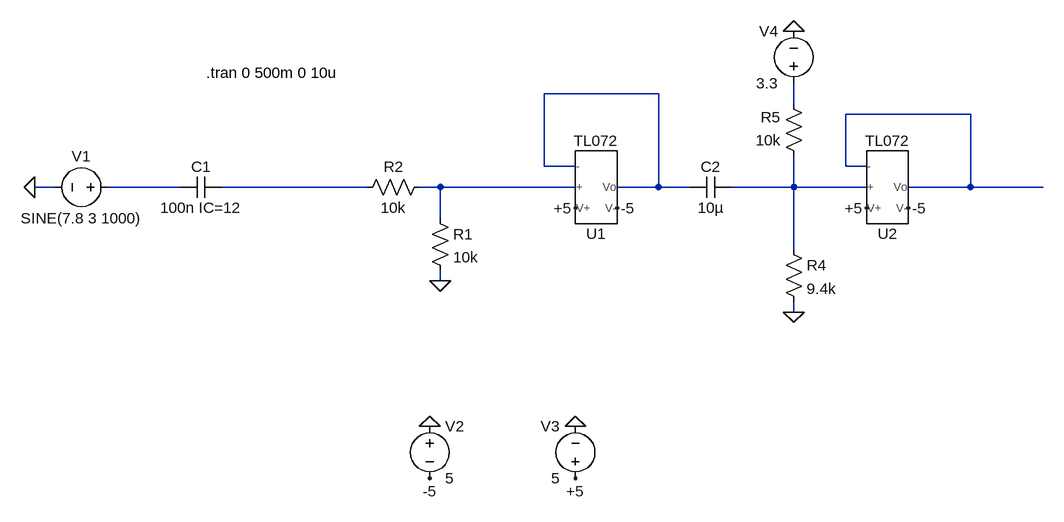
[diagram p0: schematic Draft2.asc]
Draft2.asc, the LTspice schematic file:
Version 4.1
SHEET 1 1140 680
WIRE 544 0 368 0
WIRE 752 16 752 -16
WIRE 1024 32 832 32
WIRE 368 112 368 0
WIRE 416 112 368 112
WIRE 832 112 832 32
WIRE 864 112 832 112
WIRE -384 144 -416 144
WIRE -192 144 -304 144
WIRE 96 144 -128 144
WIRE 208 144 176 144
WIRE 416 144 208 144
WIRE 544 144 544 0
WIRE 544 144 480 144
WIRE 592 144 544 144
WIRE 752 144 752 96
WIRE 752 144 656 144
WIRE 864 144 752 144
WIRE 1024 144 1024 32
WIRE 1024 144 928 144
WIRE 1136 144 1024 144
WIRE 208 192 208 144
WIRE 752 240 752 144
WIRE 208 288 208 272
WIRE 752 336 752 320
FLAG -416 144 0
FLAG 208 288 0
FLAG 192 512 0
FLAG 416 512 0
FLAG 416 592 +5
FLAG 192 592 -5
FLAG 480 176 -5
FLAG 928 176 -5
FLAG 864 176 +5
FLAG 416 176 +5
FLAG 752 -96 0
FLAG 752 336 0
SYMBOL voltage -288 144 R90
WINDOW 0 -32 56 VBottom 2
WINDOW 3 32 56 VTop 2
WINDOW 123 0 0 Left 0
WINDOW 39 0 0 Left 0
SYMATTR InstName V1
SYMATTR Value SINE(7.8 3 1000)
SYMBOL TL072 448 144 R180
SYMATTR InstName U1
SYMBOL cap -128 128 R90
WINDOW 0 0 32 VBottom 2
WINDOW 3 32 32 VTop 2
SYMATTR InstName C1
SYMATTR Value 100n IC=12
SYMBOL res 192 176 R0
SYMATTR InstName R1
SYMATTR Value 10k
SYMBOL res 192 128 R90
WINDOW 0 0 56 VBottom 2
WINDOW 3 32 56 VTop 2
SYMATTR InstName R2
SYMATTR Value 10k
SYMBOL TL072 896 144 R180
SYMATTR InstName U2
SYMBOL voltage 192 496 R0
WINDOW 123 0 0 Left 0
WINDOW 39 0 0 Left 0
SYMATTR InstName V2
SYMATTR Value 5
SYMBOL voltage 416 608 R180
WINDOW 0 24 96 Left 2
WINDOW 3 24 16 Left 2
WINDOW 123 0 0 Left 0
WINDOW 39 0 0 Left 0
SYMATTR InstName V3
SYMATTR Value 5
SYMBOL res 768 112 R180
WINDOW 0 36 76 Left 2
WINDOW 3 36 40 Left 2
SYMATTR InstName R5
SYMATTR Value 10k
SYMBOL voltage 752 0 R180
WINDOW 0 24 96 Left 2
WINDOW 3 24 16 Left 2
WINDOW 123 0 0 Left 0
WINDOW 39 0 0 Left 0
SYMATTR InstName V4
SYMATTR Value 3.3
SYMBOL cap 656 128 R90
WINDOW 0 0 32 VBottom 2
WINDOW 3 32 32 VTop 2
SYMATTR InstName C2
SYMATTR Value 10µ
SYMBOL res 736 224 R0
SYMATTR InstName R4
SYMATTR Value 9.4k
TEXT -152 -32 Left 2 !.tran 0 500m 0 10u

The netlist it stands for:
* Draft2.asc
V1 N004 0 SINE(7.8 3 1000)
X§U1 N006 N001 +5 -5 N001 TL072  ; pins + - V+ V- Vo
C1 N005 N004 100n IC=12
R1 N006 0 10k
R2 N006 N005 10k
X§U2 N007 N003 +5 -5 N003 TL072  ; pins + - V+ V- Vo
V2 0 -5 5
V3 +5 0 5
R5 N007 N002 10k
V4 N002 0 3.3
C2 N007 N001 10µ
R4 N007 0 9.4k
.tran 0 500m 0 10u
.lib /Users/cullum/Downloads/infineon-ir2110-pspice-simulationmodels-en-2/TL072.301
.backanno
.end